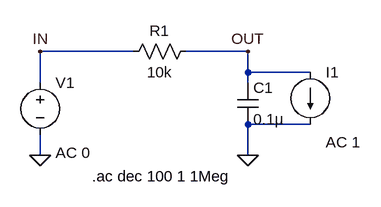
[diagram p0: schematic RC_Low_Pass_Filter_1.asc]
RC_Low_Pass_Filter_1.asc, the LTspice schematic file:
Version 4.1
SHEET 1 880 680
WIRE 176 -16 32 -16
WIRE 352 -16 256 -16
WIRE 352 16 352 -16
WIRE 448 16 352 16
WIRE 32 32 32 -16
WIRE 352 32 352 16
WIRE 448 96 352 96
WIRE 32 144 32 112
WIRE 352 144 352 96
FLAG 32 144 0
FLAG 352 144 0
FLAG 32 -16 IN
FLAG 352 -16 OUT
SYMBOL voltage 32 16 R0
WINDOW 123 24 124 Left 2
WINDOW 39 0 0 Left 0
SYMATTR InstName V1
SYMATTR Value ""
SYMATTR Value2 AC 0
SYMBOL res 272 -32 R90
WINDOW 0 0 56 VBottom 2
WINDOW 3 32 56 VTop 2
SYMATTR InstName R1
SYMATTR Value 10k
SYMBOL cap 336 32 R0
SYMATTR InstName C1
SYMATTR Value 0.1µ
SYMBOL current 448 16 R0
WINDOW 123 24 108 Left 2
WINDOW 39 0 0 Left 0
SYMATTR InstName I1
SYMATTR Value ""
SYMATTR Value2 AC 1
TEXT 112 176 Left 2 !.ac dec 100 1 1Meg

The netlist it stands for:
* RC_Low_Pass_Filter_1.asc
V1 IN 0 AC 0
R1 OUT IN 10k
C1 OUT 0 0.1µ
I1 OUT 0 AC 1
.ac dec 100 1 1Meg
.backanno
.end